# EAGLE design YouHaveBeenBlinded (EAGLE 6.6.0)
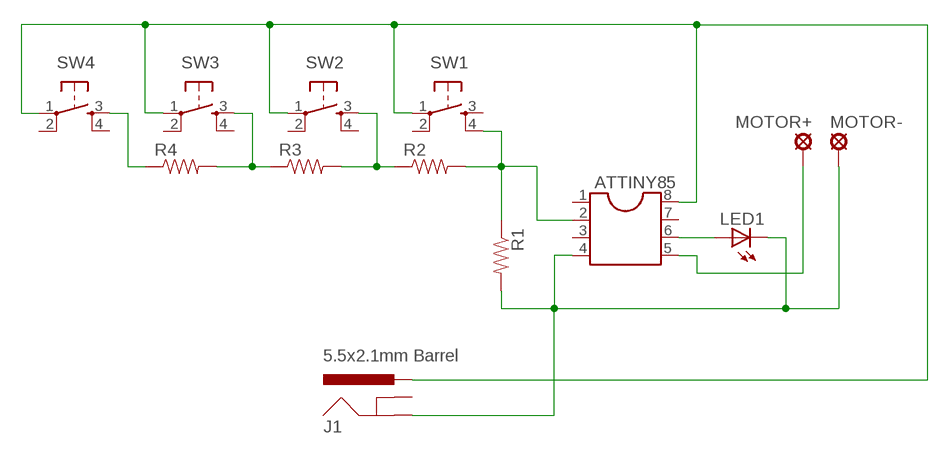
[diagram p0: schematic, sheet 1]

## Parts
ATTINY85  DIL8S  [SOCKET-08]
J1  5.5x2.1mm Barrel  POWER_JACKSMD  [POWER_JACK_SMD]
LED1  LEDCHIPLED_0805  [CHIPLED_0805]
MOTOR+  LSP10  [LSP10]
MOTOR-  LSP10  [LSP10]
R1  RESISTOR2010  [R2010]
R2  RESISTOR2010  [R2010]
R3  RESISTOR2010  [R2010]
R4  RESISTOR2010  [R2010]
SW1  TAC_SWITCHPTH  [TACTILE-PTH]
SW2  TAC_SWITCHPTH  [TACTILE-PTH]
SW3  TAC_SWITCHPTH  [TACTILE-PTH]
SW4  TAC_SWITCHPTH  [TACTILE-PTH]

## Nets
+3V: ATTINY85.8 J1.VIN0(PWR) SW1.1 SW2.1 SW3.1 SW4.1
GND: ATTINY85.4 J1.P$4(GND) LED1.C MOTOR-.MP R1.2
N$1: ATTINY85.5 MOTOR+.MP
N$4: ATTINY85.2 R1.1 R2.2 SW1.4
N$5: ATTINY85.6 LED1.A
N$17: R4.1 SW4.3
N$18: R3.1 R4.2 SW3.3
N$19: R2.1 R3.2 SW2.3
Unconnected: ATTINY85.1 ATTINY85.3 ATTINY85.7 J1.GND(GNDBREAK) SW1.2 SW1.3 SW2.2 SW2.4 SW3.2 SW3.4 SW4.2 SW4.4

## Library data of the parts
ATTINY85 = ic-package:DIL8: Dual In Line / Socket
J1 = SparkFun-Connectors:POWER_JACK: Power Jack This is the standard 5.5mm barrel jack for power. The PTH is the most common, proven, reliable, footprint. The Slot footprint only works if the mill layer is transmitted to the PCB fab house so be warned. Mating wall wart : TOL-00298 (and others); PROD_ID: CONN-08106
LED1 = led:LED: LED OSRAM: - CHIPLED LG R971, LG N971, LY N971, LG Q971, LY Q971, LO R971, LY R971 LH N974, LH R974 LS Q976, LO Q976, LY Q976 LO Q996 - Hyper CHIPLED LW Q18S LB Q993, LB Q99A, LB R99A - SideLED LS A670, LO A670, LY A670, LG A670, LP A670 LB A673, LV A673, LT A673, LW A673 LH A674 LY A675 LS A676, LA A676, LO A676, LY A676, LW A676 LS A679, LY A679, LG A679 - Hyper Micro SIDELED® LS Y876, LA Y876, LO Y876, LY Y876 LT Y87S - SmartLED LW L88C, LW L88S LB L89C, LB L89S, LG L890 LS L89K, LO L89K, LY L89K LS L896, LA L896, LO L896, LY L896 - TOPLED LS T670, LO T670, LY T670, LG T670, LP T670 LSG T670, LSP T670, LSY T670, LOP T670, LYG T670 LG T671, LOG T671, LSG T671 LB T673, LV T673, LT T673, LW T673 LH T674 LS T676, LA T676, LO T676, LY T676, LB T676, LH T676, LSB T676, LW T676 LB T67C, LV T67C, LT T67C, LS T67K, LO T67K, LY T67K, LW E67C LS E67B, LA E67B, LO E67B, LY E67B, LB E67C, LV E67C, LT E67C LW T67C LS T679, LY T679, LG T679 LS T770, LO T770, LY T770, LG T770, LP T770 LB T773, LV T773, LT T773, LW T773 LH T774 LS E675, LA E675, LY E675, LS T675 LS T776, LA T776, LO T776, LY T776, LB T776 LHGB T686 LT T68C, LB T68C - Hyper Mini TOPLED® LB M676 - Mini TOPLED Santana® LG M470 LS M47K, LO M47K, LY M47K Source: http://www.osram.convergy.de LUXEON: - LUMILED® LXK2-PW12-R00, LXK2-PW12-S00, LXK2-PW14-U00, LXK2-PW14-V00 LXK2-PM12-R00, LXK2-PM12-S00, LXK2-PM14-U00 LXK2-PE12-Q00, LXK2-PE12-R00, LXK2-PE12-S00, LXK2-PE14-T00, LXK2-PE14-U00 LXK2-PB12-K00, LXK2-PB12-L00, LXK2-PB12-M00, LXK2-PB14-N00, LXK2-PB14-P00, LXK2-PB14-Q00 LXK2-PR12-L00, LXK2-PR12-M00, LXK2-PR14-Q00, LXK2-PR14-R00 LXK2-PD12-Q00, LXK2-PD12-R00, LXK2-PD12-S00 LXK2-PH12-R00, LXK2-PH12-S00 LXK2-PL12-P00, LXK2-PL12-Q00, LXK2-PL12-R00 Source: www.luxeon.com KINGBRIGHT: KA-3528ASYC Source: www.kingbright.com
MOTOR+ MOTOR- = solpad:LSP10: SOLDER PAD drill 1.0 mm, distributor Buerklin, 12H555
R1-R4 = SparkFun:RESISTOR: Resistor Basic schematic elements and footprints for 0603, 1206, and PTH resistors.
SW1-SW4 = SparkFun:TAC_SWITCH: Momentary Switch Button commonly used for reset or general input. Spark Fun Electronics SKU : COM-00097

## Board
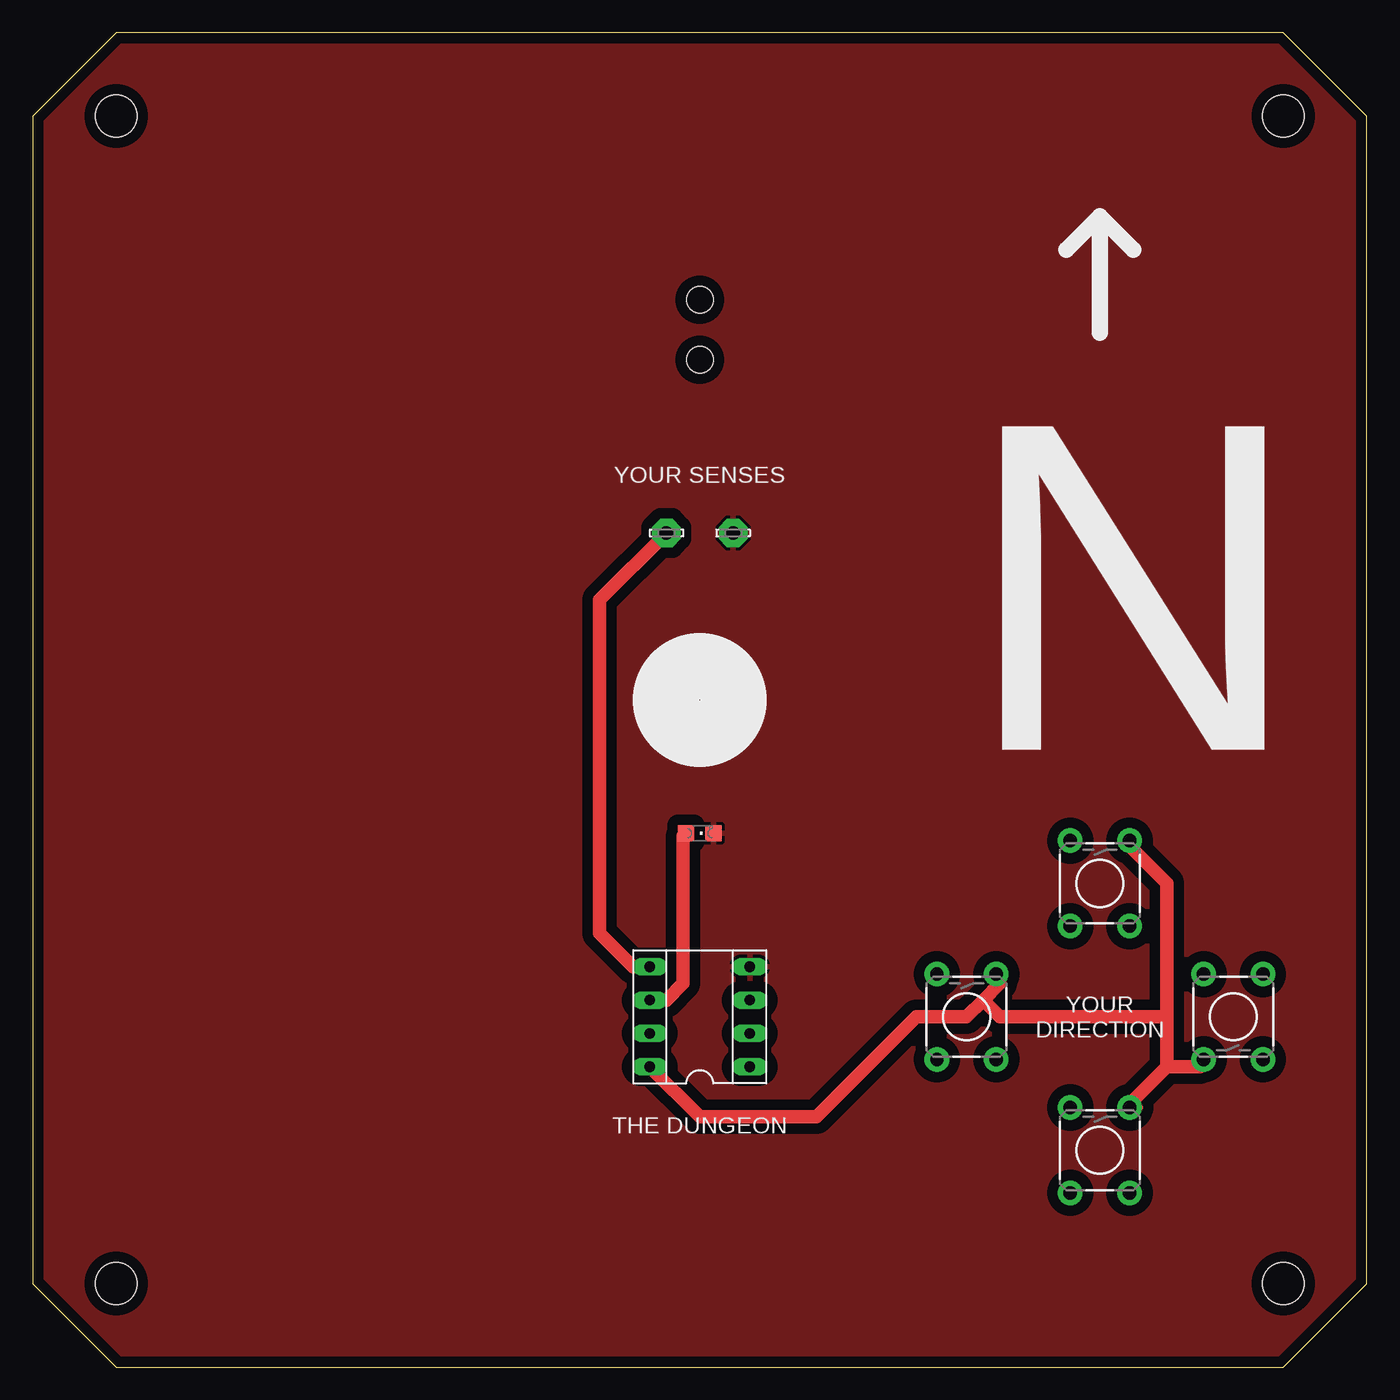
[diagram p1: board, top side]
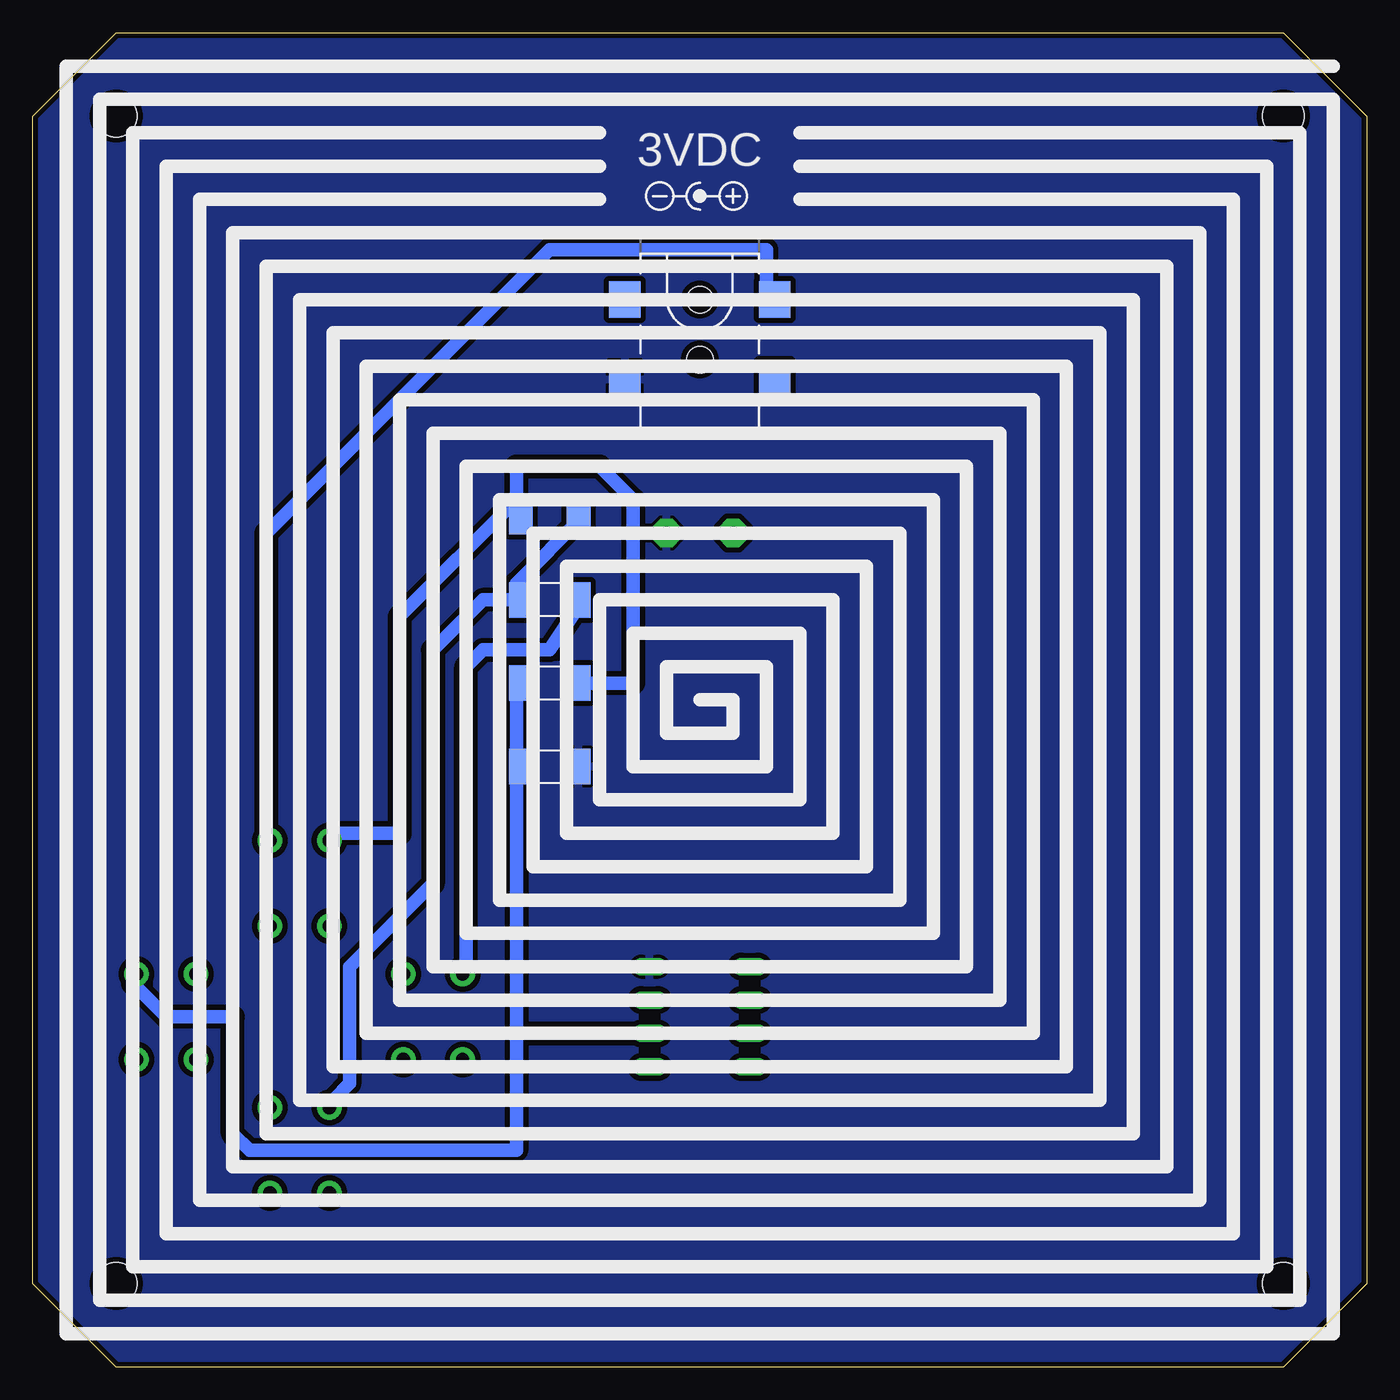
[diagram p2: board, bottom side, seen from below]

Size 101.6 x 101.59 mm. Coordinates in mm from the lower left corner, seen from the top.
Outline: 6.35,0 95.25,0 101.6,6.35 101.6,95.25 95.25,101.59 6.35,101.59 0,95.25 0,6.35 6.35,0
Copper layers (1*16): Top 0.035mm / dielectric 1.5mm / Bottom 0.035mm
Design rules "SeeedStudio_2layer_DRU_no_angle_20140221": minimum track width 6mil, minimum drill 12mil, track to track 6mil, track to pad 6mil, pad to pad 6mil, via to via 6mil, smd to smd 0mil, copper to edge 10mil, drill to drill 10mil, minimum pad ring 10mil, minimum via ring 6mil, stop-mask expansion 2mil, vias tented up to drill 100mil, thermal gap 10mil
Holes 3.2 mm at 6.35,6.35 95.25,6.35 95.25,95.25 6.35,95.25

### Footprints (pad centres in the part's own frame; a part is rotated, then mirrored left to right if it is on the bottom)
SOCKET-08 = drill 0.813 long: 1 -3.81,-3.81; 2 -1.27,-3.81; 3 1.27,-3.81; 4 3.81,-3.81; 5 3.81,3.81; 6 1.27,3.81; 7 -1.27,3.81; 8 -3.81,3.81
POWER_JACK_SMD = smd 2.8 x 2.4: GND 0,-5.7; P$4 6.1,-5.7; VIN0 0,5.7; VIN1 6.1,5.7 | hole 2.032: 0,0; 4.572,0
CHIPLED_0805 = smd 1.2 x 1.2: A 0,-1.05; C 0,1.05
LSP10 = drill 1.016 pad 2.159 octagon: MP 0,0
R2010 = smd 1.8 x 2.7: 1 -2.2,0; 2 2.2,0
TACTILE-PTH = drill 1.016 pad 1.88: 1 -3.251,2.261; 2 3.251,2.261; 3 -3.251,-2.261; 4 3.251,-2.261

### Placement (x,y rotation side)
ATTINY85  50.8,26.67 90 top
J1  50.8,81.28 270 bottom
LED1  50.8,40.64 270 top
MOTOR+  48.26,63.5 0 top
MOTOR-  53.34,63.5 0 top
R1  62.23,45.72 0 bottom
R2  62.23,52.07 180 bottom
R3  62.23,64.77 180 bottom
R4  62.23,58.42 180 bottom
SW1  91.44,26.67 90 top
SW2  81.28,36.83 270 top
SW3  81.28,16.51 270 top
SW4  71.12,26.67 270 top

### Tracks (layer width: path | path; a pad name or v marks a point on that pad's centre or on a via)
+3V
  Top 0.61: SW3.1 84.25,19.76
  Top 1.016: ATTINY85.8 50.8,19.05 59.69,19.05 67.31,26.67 71.12,26.67 72.39,27.94 | 72.39,27.94 73.66,29.21 SW4.1 | 86.36,22.86 83.82,20.32 SW3.1 | 86.36,22.86 88.9,22.86 SW1.1 | 86.36,22.86 86.36,26.67 | 86.36,26.67 86.36,36.83 83.82,39.37 SW2.1 | 72.39,27.94 73.66,26.67 86.36,26.67
  Bottom 0.406: J1.VIN0 45.72,81.28
  Bottom 1.016: SW2.1 83.82,40.64 83.82,63.5 62.23,85.09 45.72,85.09 45.72,81.28
GND
  pour Top (isolate 0.813): -6.35,102.87 102.87,102.87 102.87,-1.27 -6.35,-1.27
  pour Bottom (isolate 0.406): -1.27,102.87 109.22,102.87 109.22,-1.27 -1.27,-1.27
N$1
  Top 1.016: ATTINY85.5 45.72,30.48 43.18,33.02 43.18,58.42 MOTOR+.MP
N$4
  Bottom 1.016: 64.77,25.4 ATTINY85.2 | 64.77,45.72 64.77,25.4 | 64.77,45.72 64.77,52.07 R2.2 | 64.77,45.72 R1.1 | 64.77,25.4 64.77,16.51 85.09,16.51 86.36,17.78 86.36,26.67 91.44,26.67 93.98,29.21 SW1.4
N$5
  Top 0.61: ATTINY85.6 48.26,27.94 | 49.53,40.42 LED1.A
  Top 1.016: 48.26,27.94 49.53,29.21 49.53,40.42
N$17
  Bottom 1.016: R4.1 59.69,58.42 62.23,54.61 67.31,54.61 68.58,53.34 68.58,30.48 SW4.3
N$18
  Bottom 1.016: 64.77,58.42 64.77,59.69 59.69,64.77 R3.1 | 64.77,58.42 67.31,58.42 71.12,54.61 71.12,36.83 77.47,30.48 77.47,21.59 78.74,20.32 SW3.3 | 64.77,58.42 R4.2
N$19
  Bottom 1.016: R2.1 55.88,52.07 55.88,66.04 58.42,68.58 64.77,68.58 64.77,66.04 | 64.77,66.04 64.77,64.77 R3.2 64.77,66.04 | 64.77,66.04 73.66,57.15 73.66,40.64 78.74,40.64 SW2.3

### Text on the board
tNames: YOUR SENSES | N | YOUR / DIRECTION | THE DUNGEON
bNames: 3VDC